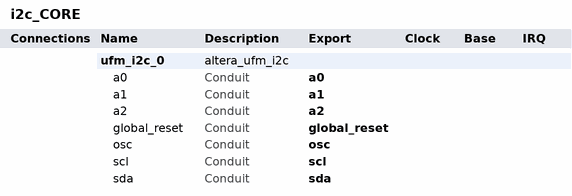
[diagram p0: system contents]
# Platform Designer (Qsys) system i2c_CORE, MAX V 5M1270ZT144C5
# Parameters at their usual value, and those the tool derives, are not listed.
package require -exact qsys 18.1
create_system i2c_CORE
set_project_property DEVICE_FAMILY {MAX V}
set_project_property DEVICE 5M1270ZT144C5

add_instance ufm_i2c_0 altera_ufm_i2c 18.1
set_instance_property ufm_i2c_0 AUTO_EXPORT true
set_instance_parameter_value ufm_i2c_0 ACCESS_MODE READ_WRITE
set_instance_parameter_value ufm_i2c_0 CBX_AUTO_BLACKBOX ALL
set_instance_parameter_value ufm_i2c_0 ERASE_METHOD MEM_ADD
set_instance_parameter_value ufm_i2c_0 FIXED_DEVICE_ADD 1010
set_instance_parameter_value ufm_i2c_0 GUI_ERASE_TIME 500000
set_instance_parameter_value ufm_i2c_0 GUI_GLOBAL_CHECK true
set_instance_parameter_value ufm_i2c_0 GUI_MEM_ADD_ERASE0 00000000
set_instance_parameter_value ufm_i2c_0 GUI_MEM_ADD_ERASE1 01000000
set_instance_parameter_value ufm_i2c_0 GUI_MEM_INIT {Initialize blank memory}
set_instance_parameter_value ufm_i2c_0 GUI_OSC_FREQUENCY 5.56
set_instance_parameter_value ufm_i2c_0 GUI_PROGRAM_TIME 1600
set_instance_parameter_value ufm_i2c_0 MEMORY_SIZE 4K
set_instance_parameter_value ufm_i2c_0 MEM_PROTECT FULL
set_instance_parameter_value ufm_i2c_0 OSCENA_CHECK false
set_instance_parameter_value ufm_i2c_0 OSC_CHECK true
set_instance_parameter_value ufm_i2c_0 PAGE_WRITE_SIZE 16
set_instance_parameter_value ufm_i2c_0 WP_CHECK false
set_instance_parameter_value ufm_i2c_0 WRITE_MODE SINGLE_BYTE

# exported interfaces
add_interface a0 conduit end
set_interface_property a0 EXPORT_OF ufm_i2c_0.a0
add_interface a1 conduit end
set_interface_property a1 EXPORT_OF ufm_i2c_0.a1
add_interface a2 conduit end
set_interface_property a2 EXPORT_OF ufm_i2c_0.a2
add_interface global_reset conduit end
set_interface_property global_reset EXPORT_OF ufm_i2c_0.global_reset
add_interface osc conduit end
set_interface_property osc EXPORT_OF ufm_i2c_0.osc
add_interface scl conduit end
set_interface_property scl EXPORT_OF ufm_i2c_0.scl
add_interface sda conduit end
set_interface_property sda EXPORT_OF ufm_i2c_0.sda

set_interconnect_requirement {$system} qsys_mm.clockCrossingAdapter HANDSHAKE
set_interconnect_requirement {$system} qsys_mm.enableEccProtection FALSE
set_interconnect_requirement {$system} qsys_mm.insertDefaultSlave FALSE
set_interconnect_requirement {$system} qsys_mm.maxAdditionalLatency 1

save_system i2c_CORE.qsys
